# EAGLE design flight_computer (EAGLE 9.6.2)
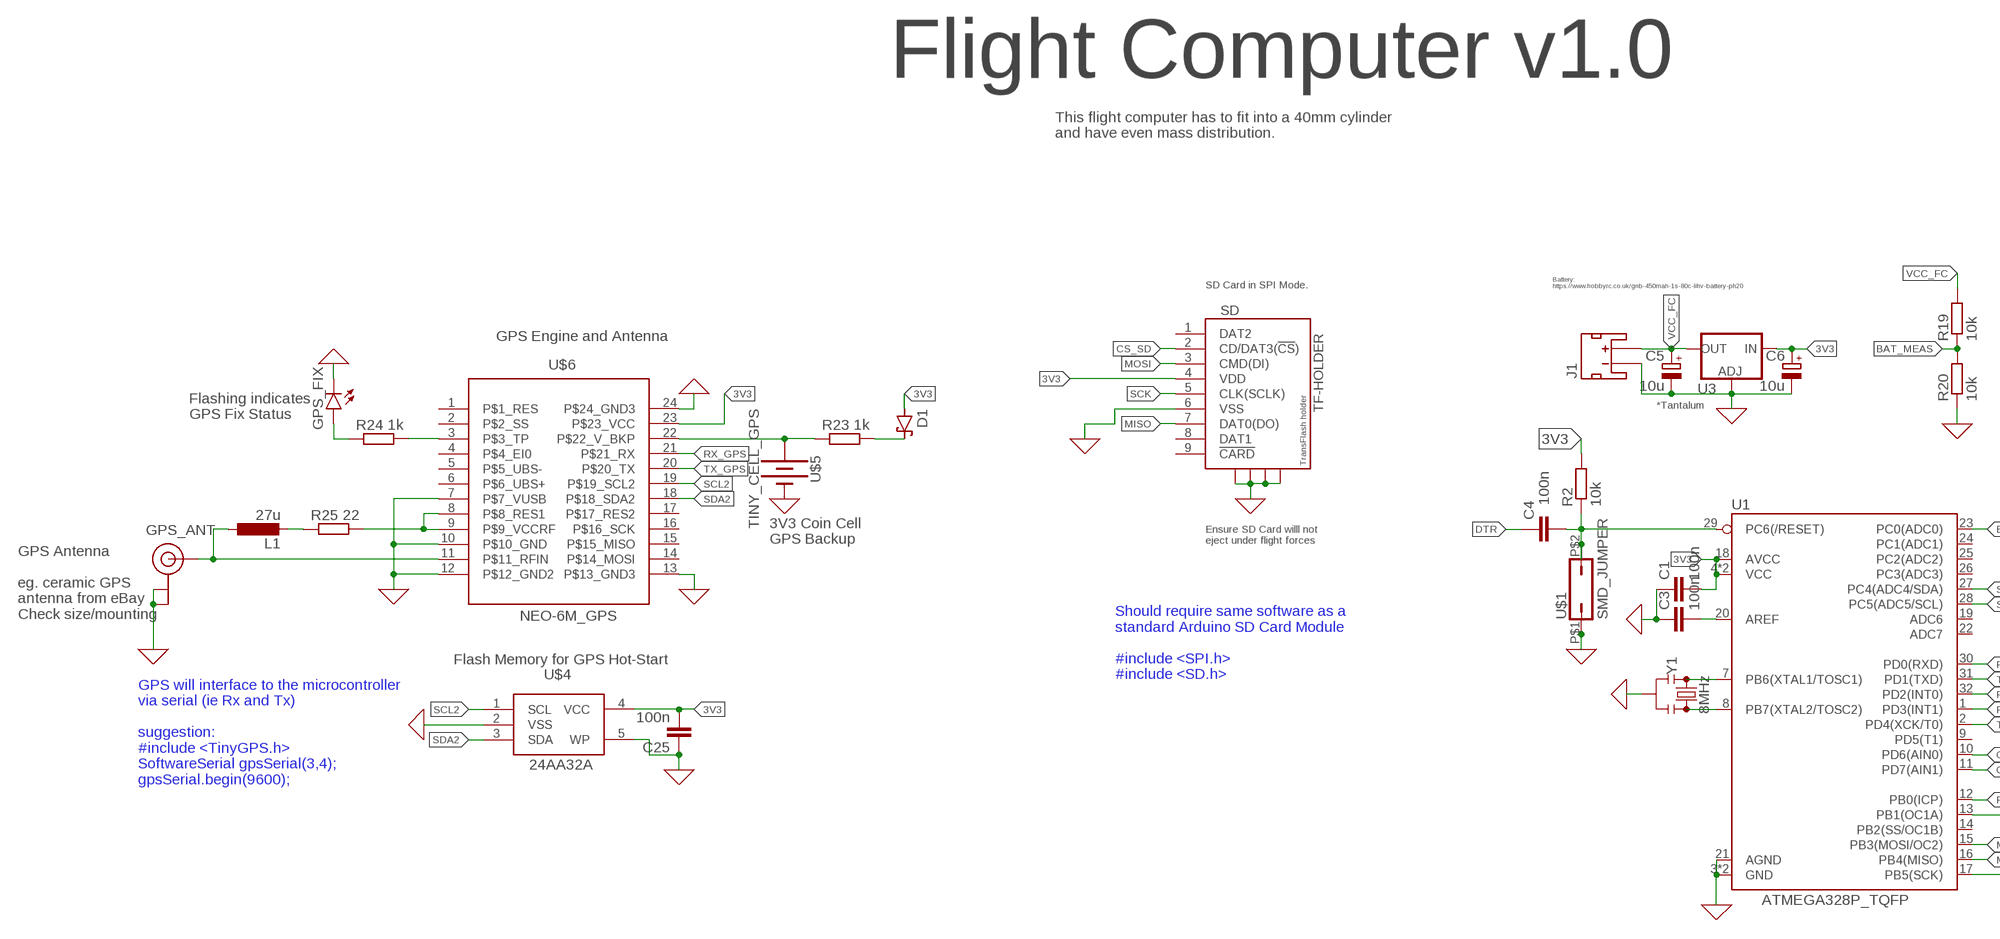
[diagram p0: schematic, sheet 1, part 1 of 2]
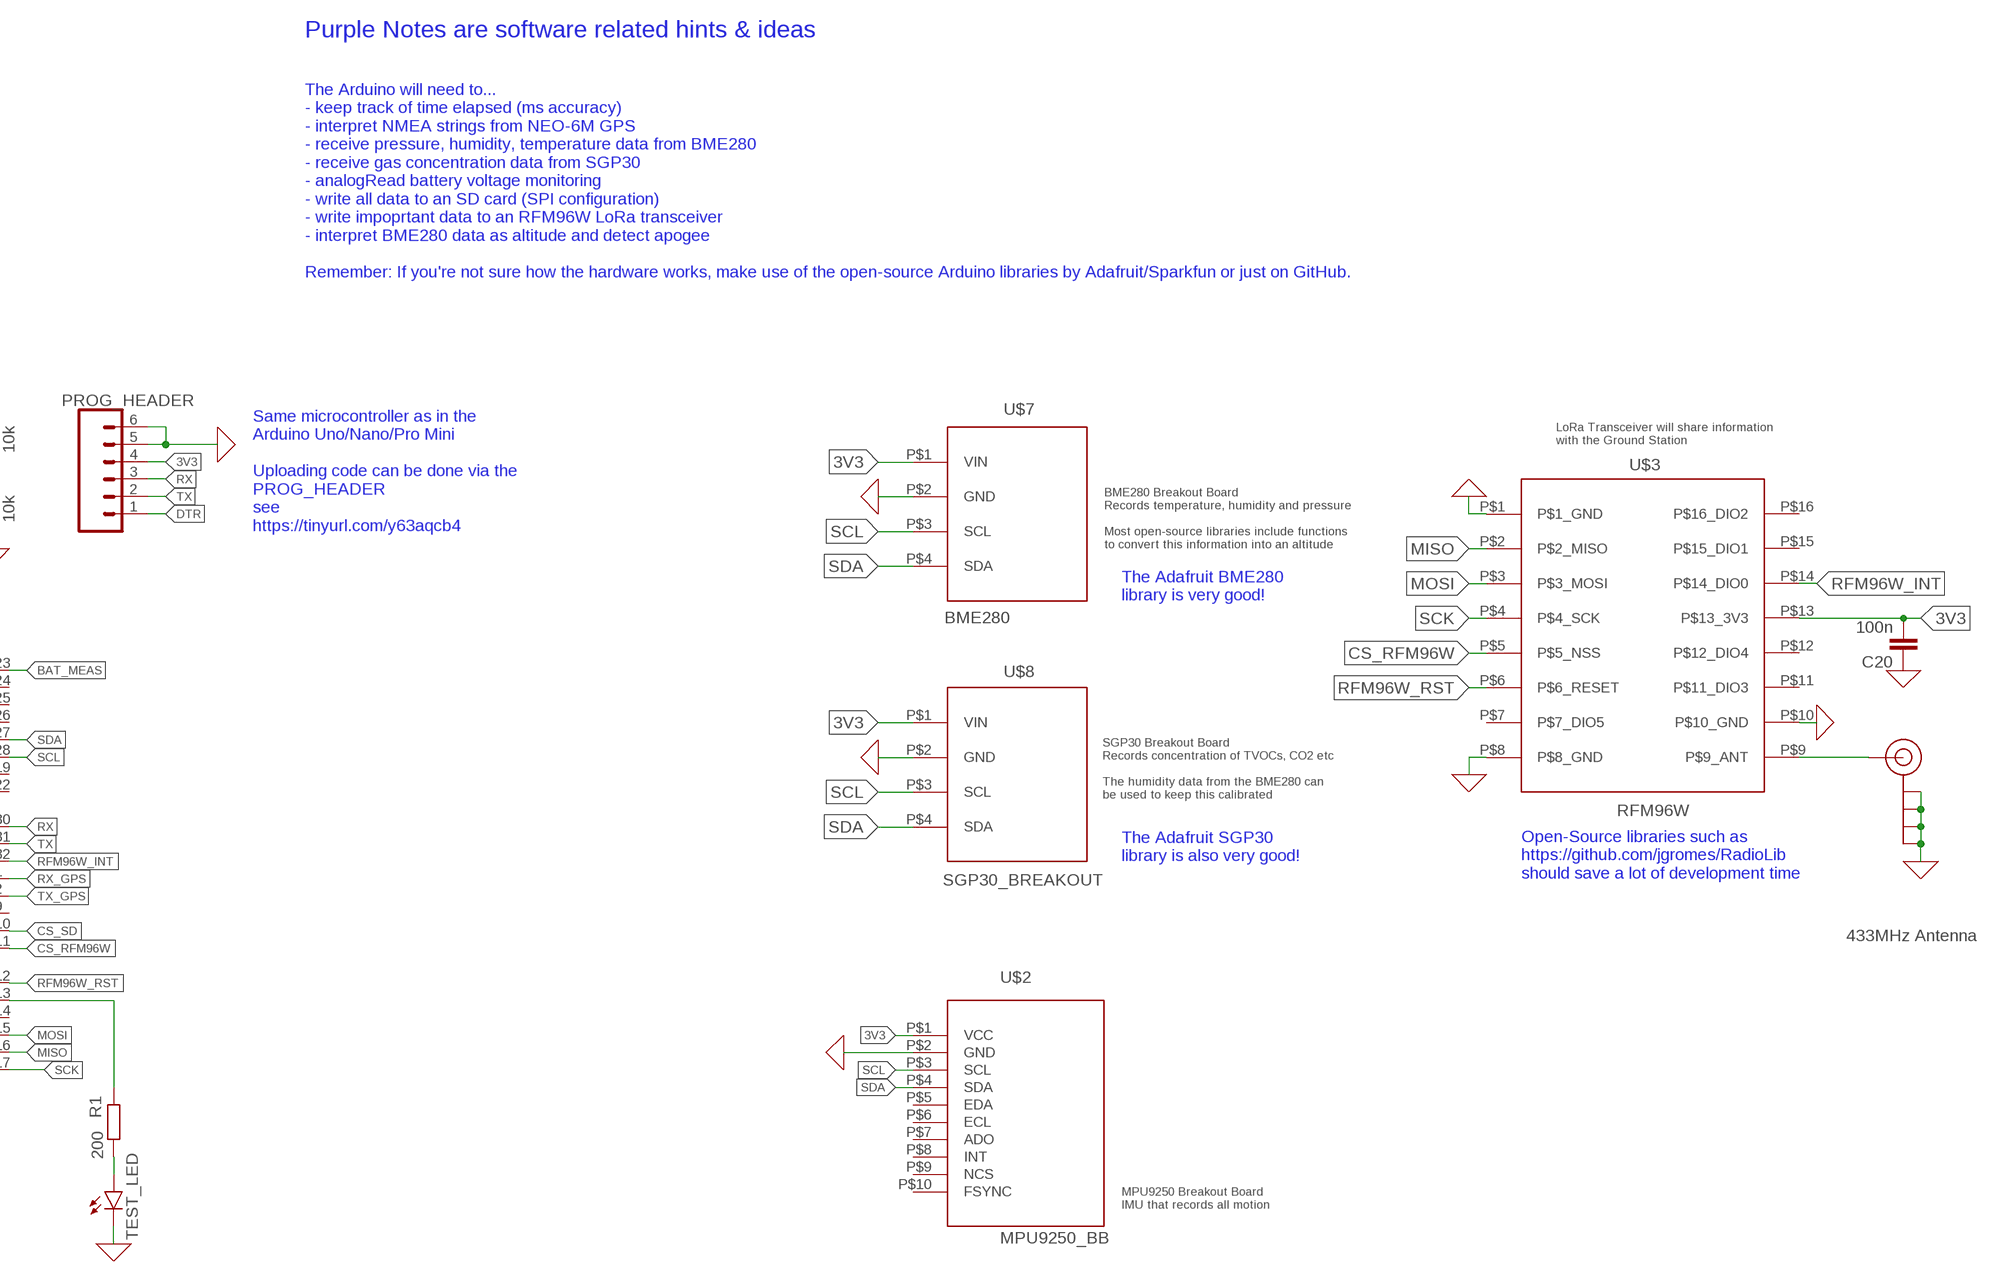
[diagram p1: schematic, sheet 1, part 2 of 2]

## Parts
C1  100n  C-EUC0603  [C0603]
C3  100n  C-EUC0603  [C0603]
C4  100n  C-EUC0603  [C0603]
C5  10u  CPOL-EUSMCA  [SMC_A]
C6  10u  CPOL-EUSMCA  [SMC_A]
C20  100n  C-EUC0603  [C0603]
C25  100n  C-EUC0603  [C0603]
D1  1A/40V/500mV  BAS40  [SOT23]
GPS_ANT  U.FL  [U.FL]
GPS_FIX  LEDCHIPLED_0603  [CHIPLED_0603]
J1  JST_2MM_MALE  [JST-2-SMD]
L1  27u  L-EUL1812  [L1812]
LORA_ANT  SMA_EDGE  [SMA-EDGE]
PROG_HEADER  CONN_06FEMALE_LOCK  [1X06_FEMALE_LOCK.010]
R1  200  R-EU_R0603  [R0603]
R2  10k  R-EU_R0603  [R0603]
R19  10k  R-EU_R0603  [R0603]
R20  10k  R-EU_R0603  [R0603]
R23  1k  R-EU_R0603  [R0603]
R24  1k  R-EU_R0603  [R0603]
R25  22  R-EU_R0603  [R0603]
SD  TF-HOLDER  [TF-PULL]
TEST_LED  LEDCHIPLED_0603  [CHIPLED_0603]
U1  ATMEGA328P_TQFP  [TQFP32-08]
U3  V_REG_LM1117SOT223  [SOT223]
U$1  SMD_JUMPER  [SMD_JUMPER]
U$2  MPU9250_BB  [MPU9250_BB]
U$3  RFM96W  [RFM96W]
U$4  24AA32A  [SOT23-5L]
U$5  TINY_CELL_GPS  [TINY_SMD_CELL]
U$6  NEO-6M_GPS  [NEO-M9N/M8T/M8U]
U$7  BME280  [BME280_BREAKOUT]
U$8  SGP30_BREAKOUT  [BME280_BREAKOUT]
Y1  8MHz  RESONATOR-8MHZSMD_3.2X1.3  [RESONATOR-SMD-3.2X1.3]

## Nets
0: C1.1 C3.1 C5.- C6.- C20.1 C25.1 GPS_ANT.1(GND) GPS_ANT.2(GND) GPS_FIX.C J1.1(-) LORA_ANT.GND@0(GND) LORA_ANT.GND@1(GND) LORA_ANT.GND@2(GND) LORA_ANT.GND@3(GND) PROG_HEADER.5 PROG_HEADER.6 R20.1 SD.6(VSS) SD.S1 SD.S2 SD.S3 SD.S4 TEST_LED.C U1.3(GND) U1.5(GND) U1.21(AGND) U3.1(ADJ) U$1.P$1 U$2.P$2(GND) U$3.P$1(P$1_GND) U$3.P$8(P$8_GND) U$3.P$10(P$10_GND) U$4.2(VSS) U$4.5(WP) U$5.P$1(-) U$6.7(P$7_VUSB) U$6.10(P$10_GND) U$6.12(P$12_GND2) U$6.13(P$13_GND3) U$6.24(P$24_GND3) U$7.P$2(GND) U$8.P$2(GND) Y1.2 ; supply symbol labelled GND
3V3: C1.2 C6.+ C20.2 C25.2 D1.1(A) PROG_HEADER.4 R2.2 SD.4(VDD) U1.4(VCC) U1.6(VCC) U1.18(AVCC) U3.3(IN) U$2.P$1(VCC) U$3.P$13(P$13_3V3) U$4.4(VCC) U$6.23(P$23_VCC) U$7.P$1(VIN) U$8.P$1(VIN)
BAT_MEAS: R19.1 R20.2 U1.23(PC0(ADC0))
CS_RFM96W: U1.11(PD7(AIN1)) U$3.P$5(P$5_NSS)
CS_SD: SD.2(CD/DAT3(!CS!)) U1.10(PD6(AIN0))
DTR: C4.1 PROG_HEADER.1
MISO: SD.7(DAT0(DO)) U1.16(PB4(MISO)) U$3.P$2(P$2_MISO)
MOSI: SD.3(CMD(DI)) U1.15(PB3(MOSI/OC2)) U$3.P$3(P$3_MOSI)
N$1: U1.7(PB6(XTAL1/TOSC1)) Y1.1
N$2: U1.8(PB7(XTAL2/TOSC2)) Y1.3
N$3: R1.1 U1.13(PB1(OC1A))
N$4: R1.2 TEST_LED.A
N$5: C4.2 R2.1 U1.29(PC6(/RESET)) U$1.P$2
N$10: C3.2 U1.20(AREF)
N$30: LORA_ANT.SIG(SIGNAL) U$3.P$9(P$9_ANT)
N$31: R23.1 U$5.P$2(+) U$6.22(P$22_V_BKP)
N$32: D1.3(C) R23.2
N$42: R24.2 U$6.3(P$3_TP)
N$43: GPS_FIX.A R24.1
N$46: R25.2 U$6.8(P$8_RES1) U$6.9(P$9_VCCRF)
N$47: GPS_ANT.FEED(SIGNAL) L1.1 U$6.11(P$11_RFIN)
N$48: L1.2 R25.1
RFM96W_INT: U1.32(PD2(INT0)) U$3.P$14(P$14_DIO0)
RFM96W_RST: U1.12(PB0(ICP)) U$3.P$6(P$6_RESET)
RX: PROG_HEADER.3 U1.30(PD0(RXD))
RX_GPS: U1.1(PD3(INT1)) U$6.21(P$21_RX)
SCK: SD.5(CLK(SCLK)) U1.17(PB5(SCK)) U$3.P$4(P$4_SCK)
SCL: U1.28(PC5(ADC5/SCL)) U$2.P$3(SCL) U$7.P$3(SCL) U$8.P$3(SCL)
SCL2: U$4.1(SCL) U$6.19(P$19_SCL2)
SDA: U1.27(PC4(ADC4/SDA)) U$2.P$4(SDA) U$7.P$4(SDA) U$8.P$4(SDA)
SDA2: U$4.3(SDA) U$6.18(P$18_SDA2)
TX: PROG_HEADER.2 U1.31(PD1(TXD))
TX_GPS: U1.2(PD4(XCK/T0)) U$6.20(P$20_TX)
VCC_FC: C5.+ J1.2(+) R19.2 U3.2(OUT) U3.4(OUT)
Unconnected: J1.NC1(PAD1) J1.NC2(PAD2) SD.1(DAT2) SD.8(DAT1) SD.9(!CARD) U1.9(PD5(T1)) U1.14(PB2(SS/OC1B)) U1.19(ADC6) U1.22(ADC7) U1.24(PC1(ADC1)) U1.25(PC2(ADC2)) U1.26(PC3(ADC3)) U$2.P$5(EDA) U$2.P$6(ECL) U$2.P$7(ADO) U$2.P$8(INT) U$2.P$9(NCS) U$2.P$10(FSYNC) U$3.P$7(P$7_DIO5) U$3.P$11(P$11_DIO3) U$3.P$12(P$12_DIO4) U$3.P$15(P$15_DIO1) U$3.P$16(P$16_DIO2) U$6.1(P$1_RES) U$6.2(P$2_SS) U$6.4(P$4_EI0) U$6.5(P$5_UBS-) U$6.6(P$6_UBS+) U$6.14(P$14_MOSI) U$6.15(P$15_MISO) U$6.16(P$16_SCK) U$6.17(P$17_RES2)

## Notes on the sheet
- Purple Notes are software related hints & ideas
- Flight Computer v1.0
- This flight computer has to fit into a 40mm cylinder
  and have even mass distribution.
- The Arduino will need to...
  - keep track of time elapsed (ms accuracy)
  - interpret NMEA strings from NEO-6M GPS
  - receive pressure, humidity, temperature data from BME280
  - receive gas concentration data from SGP30
  - analogRead battery voltage monitoring
  - write all data to an SD card (SPI configuration)
  - write impoprtant data to an RFM96W LoRa transceiver
  - interpret BME280 data as altitude and detect apogee
  
  Remember: If you're not sure how the hardware works, make use of the open-source Arduino libraries by Adafruit/Sparkfun or just on GitHub.
- SD Card in SPI Mode.
- Battery:
  https://www.hobbyrc.co.uk/gnb-450mah-1s-80c-lihv-battery-ph20
- LoRa Transceiver will share information
  with the Ground Station
- GPS Engine and Antenna
- *Tantalum
- Same microcontroller as in the 
  Arduino Uno/Nano/Pro Mini
  
  Uploading code can be done via the 
  PROG_HEADER
  see 
  https://tinyurl.com/y63aqcb4
- Flashing indicates 
  GPS Fix Status
- BME280 Breakout Board
  Records temperature, humidity and pressure
  
  Most open-source libraries include functions
  to convert this information into an altitude
- The Adafruit BME280
  library is very good!
- 3V3 Coin Cell 
  GPS Backup
- Ensure SD Card willl not
  eject under flight forces
- GPS Antenna
  
  eg. ceramic GPS
  antenna from eBay
  Check size/mounting
- SGP30 Breakout Board
  Records concentration of TVOCs, CO2 etc
  
  The humidity data from the BME280 can
  be used to keep this calibrated
- Flash Memory for GPS Hot-Start
- Should require same software as a 
  standard Arduino SD Card Module
  
  #include <SPI.h>
  #include <SD.h>
- The Adafruit SGP30
  library is also very good!
- Open-Source libraries such as
  https://github.com/jgromes/RadioLib
  should save a lot of development time
- 433MHz Antenna
- GPS will interface to the microcontroller
  via serial (ie Rx and Tx)
  
  suggestion:
  #include <TinyGPS.h>
  SoftwareSerial gpsSerial(3,4);
  gpsSerial.begin(9600);
- MPU9250 Breakout Board
  IMU that records all motion

## Library data of the parts
C1 C3 C4 C20 C25 = rcl:C-EU: CAPACITOR, European symbol; SPICEPREFIX: C
C5 C6 = rcl:CPOL-EU: POLARIZED CAPACITOR, European symbol; SPICEPREFIX: C
D1 = diode:BAS40: Silicon Schottky Diodes General-purpose diode for high-speed switching
GPS_ANT = SparkFun-Connectors:U.FL: SMD Antenna Connector - U.FL 2mm height, 3.0mm x 3.0mm receptacle size. SparkFun Products: SparkFun WiFi Shield - ESP8266 <https://www.sparkfun.com/products/13287> SparkFun ESP8266 Thing <https://www.sparkfun.com/products/13231> SparkFun MiniGen - Pro Mini Signal Generator Shield <https://www.sparkfun.com/products/11420>; PROD_ID: CONN-09193; SF_ID: WRL-09144
GPS_FIX TEST_LED = led:LED: LED OSRAM: - CHIPLED LG R971, LG N971, LY N971, LG Q971, LY Q971, LO R971, LY R971 LH N974, LH R974 LS Q976, LO Q976, LY Q976 LO Q996 - Hyper CHIPLED LW Q18S LB Q993, LB Q99A, LB R99A - SideLED LS A670, LO A670, LY A670, LG A670, LP A670 LB A673, LV A673, LT A673, LW A673 LH A674 LY A675 LS A676, LA A676, LO A676, LY A676, LW A676 LS A679, LY A679, LG A679 - Hyper Micro SIDELED® LS Y876, LA Y876, LO Y876, LY Y876 LT Y87S - SmartLED LW L88C, LW L88S LB L89C, LB L89S, LG L890 LS L89K, LO L89K, LY L89K LS L896, LA L896, LO L896, LY L896 - TOPLED LS T670, LO T670, LY T670, LG T670, LP T670 LSG T670, LSP T670, LSY T670, LOP T670, LYG T670 LG T671, LOG T671, LSG T671 LB T673, LV T673, LT T673, LW T673 LH T674 LS T676, LA T676, LO T676, LY T676, LB T676, LH T676, LSB T676, LW T676 LB T67C, LV T67C, LT T67C, LS T67K, LO T67K, LY T67K, LW E67C LS E67B, LA E67B, LO E67B, LY E67B, LB E67C, LV E67C, LT E67C LW T67C LS T679, LY T679, LG T679 LS T770, LO T770, LY T770, LG T770, LP T770 LB T773, LV T773, LT T773, LW T773 LH T774 LS E675, LA E675, LY E675, LS T675 LS T776, LA T776, LO T776, LY T776, LB T776 LHGB T686 LT T68C, LB T68C - Hyper Mini TOPLED® LB M676 - Mini TOPLED Santana® LG M470 LS M47K, LO M47K, LY M47K Source: http://www.osram.convergy.de LUXEON: - LUMILED® LXK2-PW12-R00, LXK2-PW12-S00, LXK2-PW14-U00, LXK2-PW14-V00 LXK2-PM12-R00, LXK2-PM12-S00, LXK2-PM14-U00 LXK2-PE12-Q00, LXK2-PE12-R00, LXK2-PE12-S00, LXK2-PE14-T00, LXK2-PE14-U00 LXK2-PB12-K00, LXK2-PB12-L00, LXK2-PB12-M00, LXK2-PB14-N00, LXK2-PB14-P00, LXK2-PB14-Q00 LXK2-PR12-L00, LXK2-PR12-M00, LXK2-PR14-Q00, LXK2-PR14-R00 LXK2-PD12-Q00, LXK2-PD12-R00, LXK2-PD12-S00 LXK2-PH12-R00, LXK2-PH12-S00 LXK2-PL12-P00, LXK2-PL12-Q00, LXK2-PL12-R00 Source: www.luxeon.com KINGBRIGHT: KA-3528ASYC Source: www.kingbright.com
J1 = SparkFun-Connectors:JST_2MM_MALE: Mates to single-cell LiPo batteries. CONN-08352; PROD_ID: CONN-08352
L1 = rcl:L-EU: INDUCTOR, European symbol; SPICEPREFIX: L
LORA_ANT = SparkFun-Retired:SMA_EDGE: SMA Antenna Connector End launch SMA connector. The paste layer has been removed so that the connector can be hand soldered onto the board after reflow.
PROG_HEADER = SparkFun-Connectors:CONN_06: Multi connection point. Often used as Generic Header-pin footprint for 0.1 inch spaced/style header connections On any of the 0.1 inch spaced packages, you can populate with these: Break Away Headers - Straight <https://www.sparkfun.com/products/116> (PRT-00116) Break Away Male Headers - Right Angle <https://www.sparkfun.com/products/553> (PRT-00553) Female Headers <https://www.sparkfun.com/products/115> (PRT-00115) Break Away Headers - Machine Pin <https://www.sparkfun.com/products/117> (PRT-00117) Break Away Female Headers - Swiss Machine Pin <https://www.sparkfun.com/products/743> (PRT-00743) Arduino Stackable Header - 6 Pin <https://www.sparkfun.com/products/9280> (PRT-09280) For SCREWTERMINALS and SPRING TERMINALS visit here: Screw Terimnals on SparkFun.com <https://www.sparkfun.com/search/results?term=Screw+Terminals> (5mm/3.5mm/2.54mm spacing) This device is also useful as a general connection point to wire up your design to another part of your project. Our various solder wires solder well into these plated through hole pads. Hook-Up Wire - Assortment (Stranded, 22 AWG) <https://www.sparkfun.com/products/11375> (PRT-11375) Hook-Up Wire - Assortment (Solid Core, 22 AWG) <https://www.sparkfun.com/products/11367> (PRT-11367) View the entire wire category on our website here <https://www.sparkfun.com/categories/141>
R1 R2 R19 R20 R23-R25 = rcl:R-EU_: RESISTOR, European symbol; SPICEPREFIX: R
SD = sd-mmc:TF-HOLDER: TF / Micro SD socket is PUSH-PUSH type, the card can be pushed into and auto locked and pushed out by simply press the card. Surface Mounting type.
U1 = SparkFun-IC-Microcontroller:ATMEGA328P_TQFP: Popular 328P in QFP Storefront component: ATmega328 - TQFP <https://www.sparkfun.com/products/13448> (COM-13448) Datasheet <http://www.sparkfun.com/datasheets/Components/SMD/ATMega328.pdf> SparkFun Products SparkFun RedBoard - Programmed with Arduino <https://www.sparkfun.com/products/12757> (DEV-12757) Arduino Pro Mini 328 - 5V/16MHz <https://www.sparkfun.com/products/11113> (DEV-11113) Arduino Pro Mini 328 - 3.3V/8MHz <https://www.sparkfun.com/products/11114> (DEV-11114) SparkFun OpenLog <https://www.sparkfun.com/products/13712> (DEV-13712) SparkFun MicroView - OLED Arduino Module <https://www.sparkfun.com/products/12923> (DEV-12923) SparkFun Digital Sandbox <https://www.sparkfun.com/products/12651> (DEV-12651) SparkFun PicoBoard <https://www.sparkfun.com/products/11888> (WIG-11888) Arduino Fio <https://www.sparkfun.com/products/10116> (DEV-10116) LilyPad Arduino 328 Main Board <https://www.sparkfun.com/products/13342> (DEV-13342) SparkFun RedStick <https://www.sparkfun.com/products/13741> (DEV-13741) LilyPad MP3 <https://www.sparkfun.com/products/11013> (DEV-11013) LilyPad Arduino SimpleSnap <https://www.sparkfun.com/products/10941> (DEV-10941) SparkFun Stepoko <https://www.sparkfun.com/products/13899> (ROB-13899) SparkFun Geiger Counter <https://www.sparkfun.com/products/11345> (SEN-11345) SparkFun EL Sequencer <https://www.sparkfun.com/products/12781> (COM-12781) Arduino Pro 328 - 5V/16MHz <https://www.sparkfun.com/products/10915> (DEV-10915) CryptoCape <https://www.sparkfun.com/products/12773> (DEV-12773) SparkFun IR Thermometer Evaluation Board - MLX90614 <https://www.sparkfun.com/products/10740> (SEN-10740) SparkFun RedBot Mainboard <https://www.sparkfun.com/products/12097> (ROB-12097) Arduino Pro 328 - 3.3V/8MHz <https://www.sparkfun.com/products/10914> (DEV-10914) SparkFun Block for Intel® Edison - Arduino <https://www.sparkfun.com/products/13036> (DEV-13036) SparkFun Simon Says - Surface Mount Soldering Kit <https://www.sparkfun.com/products/10935> (KIT-10935) SparkFun 7-Segment Serial Display - Red <https://www.sparkfun.com/products/11441> (COM-11441) SparkFun 7-Segment Serial Display - White <https://www.sparkfun.com/products/11629> (COM-11629) SparkFun 7-Segment Serial Display - Yellow <https://www.sparkfun.com/products/11443> (COM-11443) SparkFun 7-Segment Serial Display - Kelly Green <https://www.sparkfun.com/products/11440> (COM-11440) SparkFun 7-Segment Serial Display - Blue <https://www.sparkfun.com/products/11442> (COM-11442) SparkFun OpenSegment Serial Display - 20mm (Blue) <https://www.sparkfun.com/products/11647> (COM-11647) SparkFun OpenSegment Serial Display - 20mm (Green) <https://www.sparkfun.com/products/11646> (COM-11646) SparkFun OpenSegment Serial Display - 20mm (White) <https://www.sparkfun.com/products/11648> (COM-11648) SparkFun OpenSegment Serial Display - 20mm (Red) <https://www.sparkfun.com/products/11644> (COM-11644) SparkFun OpenSegment Serial Display - 20mm (Yellow) <https://www.sparkfun.com/products/11645> (COM-11645) SparkFun OpenSegment Shield <https://www.sparkfun.com/products/13190> (DEV-13190); PROD_ID: IC-09069
U3 = SparkFun-IC-Power:V_REG_LM1117: Voltage Regulator LM1117 Standard adjustable voltage regulator but in SMD form. Spark Fun Electronics SKU : COM-00595; PROD_ID: VREG-08170
U$1 = Josh's_Lib:SMD_JUMPER: SMD Jumper for reset, just short the pads
U$2 = Josh's_Lib:MPU9250_BB: MPU9250 Breakout Board
U$3 = Josh's_Lib:RFM96W: RFM96W LoRa Transciever https://cdn.sparkfun.com/assets/learn_tutorials/8/0/4/RFM95_96_97_98W.pdf
U$4 = Josh's_Lib:24AA32A: 24AA32A http://ww1.microchip.com/downloads/en/DeviceDoc/21713M.pdf https://uk.rs-online.com/web/p/eeprom/8230701/
U$5 = Josh's_Lib:TINY_CELL_GPS: a tiny cell copied form the neo-6m GPS breakout board
U$6 = Josh's_Lib:NEO-6M_GPS: NEO-6M GPS https://www.u-blox.com/sites/default/files/products/documents/NEO-6_DataSheet_%28GPS.G6-HW-09005%29.pdf
U$7 = Josh's_Lib:BME280
U$8 = Josh's_Lib:SGP30_BREAKOUT: SGP30 Breakout Board
Y1 = SparkFun-Clocks:RESONATOR-8MHZ: 8MHz Resonator Digikey Example <http://www.digikey.com/product-detail/en/murata-electronics-north-america/CSTCE10M0G55-R0/490-1196-1-ND/584633> Frequency: 8MHz Frequency Stability: ±0.2% Frequency Tolerance: ±0.5% Capacitance: 33pF SparkFun Products Arduino Pro Mini 328- 3.3V/8MHz <https://www.sparkfun.com/products/11114> SparkFun Digital Sandbox <https://www.sparkfun.com/products/12651>; PROD_ID: XTAL-08895

## Module VE
Ports: 

### Library data of the parts

## Net classes
1 vcc: width 0.203 mm

## Board
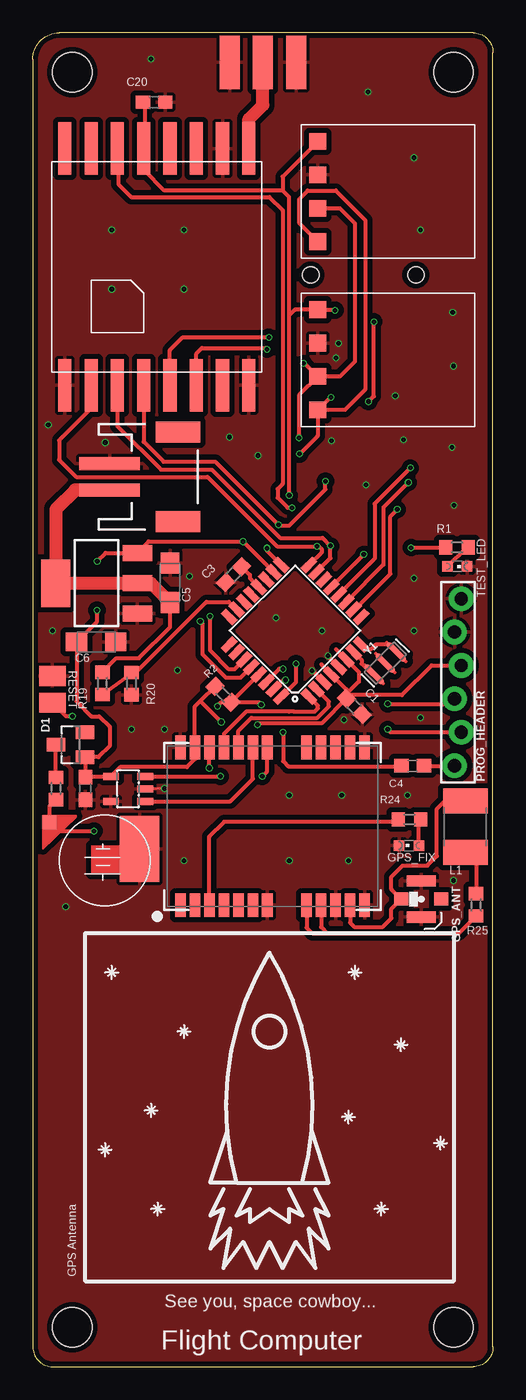
[diagram p2: board, top side]
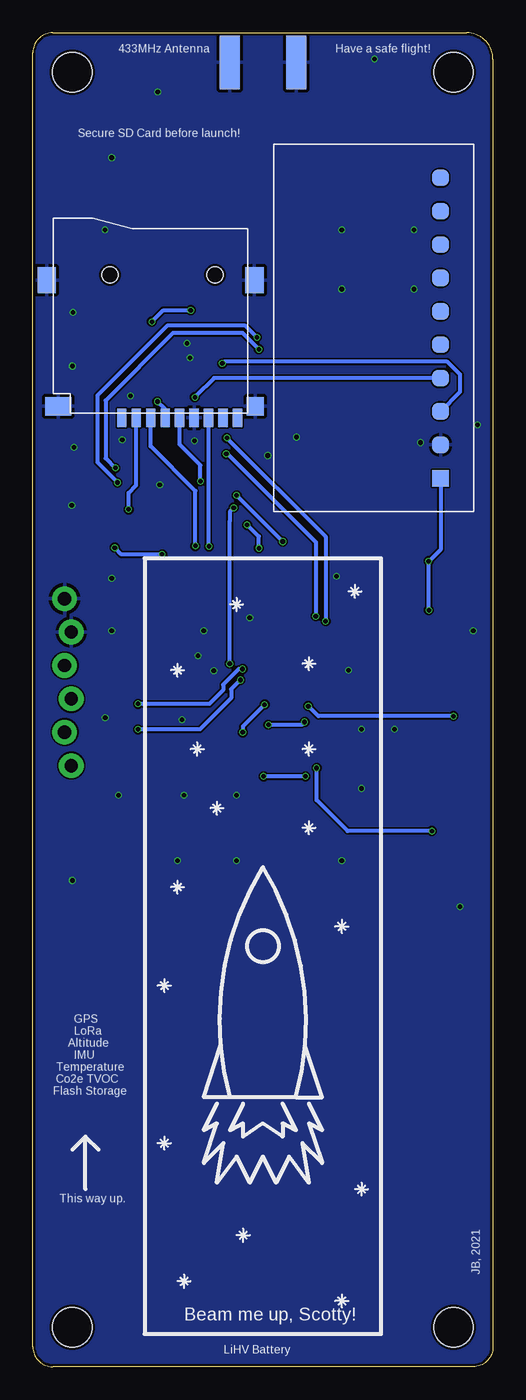
[diagram p3: board, bottom side, seen from below]

Size 35 x 101.5 mm. Coordinates in mm from the lower left corner, seen from the top.
Outline: 1.5,0 33.5,0 arc90 35,1.5 35,100 arc90 33.5,101.5 2,101.5 arc90 0,99.5 0,1.5 arc90 1.5,0
Copper layers (1*16): Top 0.035mm / dielectric 1.6mm / Bottom 0.035mm
Design rules "jlcpcb-2layers": minimum track width 5mil, minimum drill 0.3mm, track to track 5mil, track to pad 5mil, pad to pad 5mil, via to via 5mil, smd to smd 5mil, copper to edge 0.2mm, drill to drill 6mil, minimum pad ring 10mil, minimum via ring 3mil, stop-mask expansion 4mil, vias tented up to drill 0mil, thermal gap 10mil
Holes 3 mm at 3,3 32,3 3,98.5 32,98.5

### Footprints (pad centres in the part's own frame; a part is rotated, then mirrored left to right if it is on the bottom)
C0603 = smd 1.1 x 1: 1 -0.85,0; 2 0.85,0
SMC_A = smd 1.6 x 1.4: + -1.5,0; - 1.5,0
SOT23 = smd 1 x 1.4: 1 -0.95,-1.1; 2 0.95,-1.1; 3 0,1.1
U.FL = smd 2.2 x 0.85: 1 0,1.375; 2 0,-1.375 | smd 1.05 x 1: FEED 1.525,0; NC -1.525,0
CHIPLED_0603 = smd 0.8 x 0.8: A 0,-0.75; C 0,0.75
JST-2-SMD = smd 1 x 4.6: 1 -1,-3.7; 2 1,-3.7 | smd 1.6 x 3.4: NC1 -3.4,1.5; NC2 3.4,1.5
L1812 = smd 1.9 x 3.4: 1 -1.95,0; 2 1.95,0
SMA-EDGE = smd 1.524 x 4.064: GND@0 0,0; GND@1 5.08,0; SIG 2.54,0 | smd 1.524 x 4.064 bottom: GND@2 0,0; GND@3 5.08,0
1X06_FEMALE_LOCK.010 = drill 1.016 pad 1.88: 1 0,0.254; 2 2.54,-0.254; 3 5.08,0.254; 4 7.62,-0.254; 5 10.16,0.254; 6 12.7,-0.254
R0603 = smd 1 x 1.1: 1 -0.85,0; 2 0.85,0
TF-PULL = smd 0.7 x 1.4: 1 -2.2,-7.62; 2 -1.1,-7.62; 3 0,-7.62; 4 1.1,-7.62; 5 2.2,-7.62; 6 3.3,-7.62; 7 4.4,-7.62; 8 5.5,-7.62; 9 6.6,-7.62 | smd 1.4 x 2: S1 -7.9,2.85; S2 7.9,2.85 | smd 1.28 x 1.4: S3 7.96,-6.75 | smd 1.95 x 1.4: S4 -7.025,-6.75 | hole 1.25: -3.1,3.25; 4.9,3.25
TQFP32-08 = smd 1.27 x 0.559: 1 -4.293,2.8; 2 -4.293,2; 3 -4.293,1.2; 4 -4.293,0.4; 5 -4.293,-0.4; 6 -4.293,-1.2; 7 -4.293,-2; 8 -4.293,-2.8; 17 4.293,-2.8; 18 4.293,-2; 19 4.293,-1.2; 20 4.293,-0.4; 21 4.293,0.4; 22 4.293,1.2; 23 4.293,2; 24 4.293,2.8 | smd 0.559 x 1.27: 9 -2.8,-4.293; 10 -2,-4.293; 11 -1.2,-4.293; 12 -0.4,-4.293; 13 0.4,-4.293; 14 1.2,-4.293; 15 2,-4.293; 16 2.8,-4.293; 25 2.8,4.293; 26 2,4.293; 27 1.2,4.293; 28 0.4,4.293; 29 -0.4,4.293; 30 -1.2,4.293; 31 -2,4.293; 32 -2.8,4.293
SOT223 = smd 1.219 x 2.235: 1 -2.311,-3.099; 2 0,-3.099; 3 2.311,-3.099 | smd 3.6 x 2.2: 4 0,3.099
SMD_JUMPER = smd 1.5 x 2: P$1 0,0; P$2 2.032,0
MPU9250_BB = smd 1.27 x 1.27: P$1 0,0; P$2 0,-2.54; P$3 0,-5.08; P$4 0,-7.62; P$5 0,-10.16; P$6 0,-12.7; P$7 0,-15.24; P$8 0,-17.78; P$9 0,-20.32; P$10 0,-22.86
RFM96W = smd 4 x 1: P$1 -1,15; P$2 -1,13; P$3 -1,11; P$4 -1,9; P$5 -1,7; P$6 -1,5; P$7 -1,3; P$8 -1,1; P$9 17,1; P$10 17,3; P$11 17,5; P$12 17,7; P$13 17,9; P$14 17,11; P$15 17,13; P$16 17,15
SOT23-5L = smd 0.55 x 1.2: 1 -0.95,-1.3; 2 0,-1.3; 3 0.95,-1.3; 4 0.95,1.3; 5 -0.95,1.3
TINY_SMD_CELL = smd 3 x 5: P$1 1.524,2.54 | smd 1 x 1: P$2 8.382,0.508
NEO-M9N/M8T/M8U = smd 1.8 x 0.8: 1 6,-7; 2 6,-5.9; 3 6,-4.8; 4 6,-3.7; 5 6,-2.6; 6 6,-1.5; 7 6,-0.4; 8 6,2.6; 9 6,3.7; 10 6,4.8; 11 6,5.9; 12 6,7; 13 -6,7; 14 -6,5.9; 15 -6,4.8; 16 -6,3.7; 17 -6,2.6; 18 -6,-0.4; 19 -6,-1.5; 20 -6,-2.6; 21 -6,-3.7; 22 -6,-4.8; 23 -6,-5.9; 24 -6,-7
BME280_BREAKOUT = smd 1.27 x 1.27: P$1 0,3.81; P$2 0,1.27; P$3 0,-1.27; P$4 0,-3.81
RESONATOR-SMD-3.2X1.3 = smd 0.45 x 1.905: 1 -1.2,0; 2 0,0; 3 1.2,0

### Placement (x,y rotation side)
C1  24.45,50.23 135 top
C3  15.27,60.28 45 top
C4  28.89,45.73 180 top
C5  10.44,59.66 90 top
C6  4.82,55.15 0 top
C20  9.22,96.23 180 top
C25  4,43.99 90 top
D1  2.86,47.33 90 top
GPS_ANT  29.54,35.58 180 top
GPS_FIX  28.62,39.66 90 top
J1  9.53,67.71 270 top
L1  32.9,41.09 270 top
LORA_ANT  14.96,99.26 0 top
PROG_HEADER  32.33,45.74 90 top
R1  32.27,62.34 0 top
R2  14.47,51.16 135 top
R19  5.28,51.99 90 top
R20  7.5,51.98 90 top
R23  1.76,43.99 90 top
R24  28.65,41.64 180 top
R25  33.72,35.14 270 top
SD  26.04,79.83 0 bottom
TEST_LED  32.29,60.89 270 top
U1  19.95,56 135 top
U3  4.85,59.62 90 top
U$1  1.49,52.56 270 top
U$2  3.99,67.61 180 bottom
U$3  17.43,75.69 90 top
U$4  7.24,43.97 90 top
U$5  9.65,41.94 180 top
U$6  18.23,41.12 270 top
U$7  21.67,89.42 0 top
U$8  21.67,76.62 0 top
Y1  26.8,53.54 45 top

### Tracks (layer width: path | path; a pad name or v marks a point on that pad's centre or on a via)
0  (via drill 0.35)
  Top 0.2: U$4.2 8.54,44 v10,44
  Top 0.3: U1.5 22.45,54.07 v22.45,54.09 | U1.3 22.09,52.12 v21.24,52.97
  other vias: 10,48.5 7.5,48.5 19.5,43.5 23.5,43.5 28.5,43.5 24,38.5 19.5,38.5 11.5,38.5 2.5,35 32,37 18.5,57 22,56 29,56 29,60 11.91,60.13 1.17,71.68 5.51,70.32 14.95,70.74 17.13,69.33 22.71,70.44 25.35,67.12 28.2,70.53 32.04,65.55 31.88,69.96 32,76.14 31.94,80.23 6,86.5 6,82 11.5,86.5 11.5,82 29.5,86.5 29,92 25.5,97 9,99.5 11,53 1.5,56 29.49,49.39 23.66,49.24 23.26,77.87 23.06,76.77 27.57,73.88
  pour Top (isolate 0.4): -0.5,-0.5 -0.5,102 14,102 35.5,102 35.5,97.5 35.5,-0.5 1.5,-0.5
  pour Bottom: -0.5,-1 36,-1 36,0 36,102.5 24,102.5 -1,102.5 -1,99.5 -1,-1
3V3  (via drill 0.35)
  Top 0.3: 23.85,51.17 23.85,51.54 U1.4 21.95,53.43 | 23.85,51.17 C1.2 | U1.18 v15.99,62.79 8.81,62.79 U3.3 5.53,61.93 v4.9,61.3 | v4.88,57.57 4.88,56.71 C6.+ 3.32,50.63 4.46,49.49 5.05,49.49 5.83,48.71 5.83,47.22 4.99,46.38 D1.1 4,46.34 C25.2 4.08,44.92 U$4.4 6.65,45.63 11.72,45.63 12.33,46.24 U$6.23 12.33,50.22 12.75,50.64 | R2.2 12.75,50.64 | 23.07,54.58 U1.6 24.8,52.85 24.8,52.12 23.85,51.17 | C1.2 24.12,51.1 28.07,51.1 30.33,53.36 PROG_HEADER.4 | C1.2 21.97,48.95 17.18,48.95 v17.08,48.85 | v14.33,49.06 12.75,50.64 | C20.2 8.5,96.1 8.5,92.76 | 8.5,92.76 U$3.P$13 | 19,89.5 19.5,89 19.5,80 | 8.5,92.76 8.5,91 10,89.5 19,89.5 | v19.5,66.3 19.5,80 | U$7.P$1 19,90.56 19,89.5 | 19.5,80 19.93,80.43 U$8.P$1 21.71,80.39 v22.99,80.39 | v25.53,73.44 25.94,73.85 v25.94,79.52
  Bottom 0.3: v4.88,57.57 4.88,61.28 | 4.88,61.28 v4.9,61.3 | v17.08,48.85 14.54,48.85 v14.33,49.06 | U$2.P$1 3.99,62.17 4.88,61.28 | v15.99,62.79 v19.5,66.3 | SD.4 24.94,72.85 v25.53,73.44 | v25.94,79.52 25.07,80.39 v22.99,80.39
BAT_MEAS
  Top 0.3: R19.1 7.24,52.56 R20.2 7.83,52.83 13.2,58.2 14.91,58.2 U1.23
CS_RFM96W  (via drill 0.35)
  Top 0.3: U$3.P$5 10.43,77.35 11.41,78.33 v17.95,78.33 | v28.56,67.28 26.67,65.39 26.67,61.02 U1.11
  Bottom 0.3: v17.95,78.33 18.83,79.21 24.79,79.21 30.1,73.9 30.1,68.82 v28.56,67.28
CS_SD  (via drill 0.35)
  Top 0.3: U1.10 24.48,57.62 27.19,60.33 27.19,64.7 v27.72,65.23
  Bottom 0.3: v27.72,65.23 27.72,66.49 27.14,67.07 SD.2
DTR
  Top 0.3: C4.1 32.06,45.72 PROG_HEADER.1
MISO  (via drill 0.35)
  Top 0.3: U$3.P$2 4.43,72.93 2,70.5 2,69 3.3,67.7 13.3,67.7 18.58,62.42 v21.6,62.42 21.75,62.42 21.96,62.21 21.96,61.97 U1.16
  Bottom 0.3: SD.7 21.64,62.46 v21.6,62.42
MOSI  (via drill 0.35)
  Top 0.3: U$3.P$3 6.43,71.57 9.75,68.25 13.61,68.25 18.8,63.06 22.04,63.06 v22.64,62.46 22.64,61.52 U1.15
  Bottom 0.3: v22.64,62.46 22.64,66.64 26.04,70.04 SD.3
N$1
  Top 0.3: U1.7 25,53.78 25,53.5 25.81,52.69 Y1.1
N$2
  Top 0.3: U1.8 25.29,54.62 25.76,54.62 26.13,54.99 27.05,54.99 Y1.3
N$3  (via drill 0.35)
  Top 0.3: U1.13 25.17,61.79 v25.17,61.81 | v28.77,62.32 28.79,62.34 R1.1
  Bottom 0.3: v25.17,61.81 27.5,61.81 28.26,61.81 v28.77,62.32
N$4
  Top 0.3: TEST_LED.A 32.99,62.34 R1.2
N$5  (via drill 0.35)
  Top 0.3: R2.1 U1.29 | R2.1 17.19,50.56 v17.37,50.38 | v19.03,48.27 19.03,46.09 19.43,45.69 28,45.69 C4.2 | U$1.P$2 2.52,49.5 v3,49.5 | v14.05,50.27 14.34,50.56 R2.1
  Bottom 0.3: v17.37,50.38 19.03,48.72 v19.03,48.27 | v3,49.5 13.28,49.5 v14.05,50.27
N$10
  Top 0.3: C3.2 16.5,60.25 16.5,60 17.18,59.32 U1.20
N$30
  Top 1: U$3.P$9 16.43,94.93 17.5,96 LORA_ANT.SIG 17.5,100
N$31  (via drill 0.35)
  Top 0.3: R23.1 1.27,42.65 U$5.P$2 1.94,40.76 v4.65,40.76 | v13.42,45.56 U$6.22
  Bottom 0.3: v4.65,40.76 11.06,40.76 13.42,43.12 v13.42,45.56
N$32
  Top 0.3: R23.2 D1.3
N$42
  Top 0.3: U$6.3 13.43,40.34 14.54,41.45 27.61,41.45 R24.2
N$43
  Top 0.3: GPS_FIX.A 29.37,41.51 R24.1
N$46
  Top 0.3: U$6.9 21.93,33.45 22.4,32.98 | 22.4,32.98 23.08,32.98 32.41,32.98 R25.2 | U$6.8 20.83,33.4 21.25,32.98 22.4,32.98
N$47
  Top 0.3: 24.16,35.15 U$6.11 24.13,33.78 24.44,33.47 26.62,33.47 27.27,34.12 27.27,34.84 GPS_ANT.FEED 27.27,36.33 27.27,37.28 28.13,38.14 30.02,38.14 30.73,38.85 30.73,42.45 31.32,43.04 L1.1
N$48
  Top 0.3: L1.2 33.72,38.32 R25.1
RFM96W_INT  (via drill 0.35)
  Top 0.3: U1.32 20.02,52.11 v20.02,53.5 | U$3.P$14 6.5,92.62 6.5,90 7.5,89 18,89 19,88 19,67.17 18.62,66.79 18.62,66.12 19.38,65.36 v19.72,65.36
  Bottom 0.3: v20.02,53.5 20.02,64.37 20.02,64.52 20.02,65.06 v19.72,65.36
RFM96W_RST  (via drill 0.35)
  Top 0.3: U$3.P$6 12.43,77.1 12.85,77.52 17.71,77.52 v17.81,77.42 | v28.72,68.39 26,65.67 26,61.48 U1.12
  Bottom 0.3: v17.81,77.42 19.05,78.66 24.34,78.66 29.47,73.53 29.47,69.14 v28.72,68.39
RX  (via drill 0.35)
  Top 0.3: U1.30 18.74,53.09 v19.04,53.09 | v27,50.44 31.69,50.44 PROG_HEADER.3
  Bottom 0.3: v19.04,53.09 19.33,53.09 20.52,51.9 20.52,51.49 21.57,50.44 v27,50.44
RX_GPS
  Top 0.3: U$6.21 14.53,48.16 16.22,49.85 19.5,49.85 19.87,49.85 21.43,49.85 21.68,50.1 21.68,50.31 U1.1
SCK  (via drill 0.35)
  Top 0.3: U$3.P$4 8.43,70.39 9.95,68.87 13.89,68.87 v18.7,64.06 18.76,64 19.5,64 22.26,66.76 v22.26,67.38 | U1.17 17.81,62.1 v17.81,62.29
  Bottom 0.3: v22.26,67.38 22.26,68.59 23.84,70.17 SD.5 | v17.81,62.29 17.81,63.17 v18.7,64.06
SCL  (via drill 0.35)
  Top 0.3: U1.28 15.79,52.41 14.71,52.41 12.92,54.2 12.92,56.53 v12.73,56.72 | U$7.P$3 23.35,88.15 24.5,87 24.5,76.5 23.35,75.35 U$8.P$3 | U$8.P$3 20.24,73.92 v20.24,70.67 | v20.59,76.34 20.68,76.34 U$8.P$3
  Bottom 0.3: v12.73,56.72 12.73,63.16 v20.24,70.67 | U$2.P$3 2.5,74.18 2.5,75.5 3.47,76.47 20.46,76.47 v20.59,76.34
SCL2
  Top 0.3: U$4.1 15.02,43.02 16.73,44.73 U$6.19
SDA  (via drill 0.35)
  Top 0.3: U1.27 15.32,53.07 14.91,53.07 13.5,54.48 13.5,57.09 v13.48,57.11 | U$7.P$4 20.28,87 20.28,88.86 20.91,89.49 23.05,89.49 25.28,87.26 25.28,74.35 23.74,72.81 U$8.P$4 21.67,72.77 | 21.67,72.77 21.67,70.83 v20.29,69.45 | v22.67,73.77 21.67,72.77
  Bottom 0.3: v20.29,69.45 20.18,69.45 13.48,62.75 v13.48,57.11 | U$2.P$4 21.22,75.23 22.56,73.89 22.56,73.88 v22.67,73.77
SDA2  (via drill 0.35)
  Top 0.3: U$4.3 v14.26,44.92 | v17.45,44.92 17.83,45.3 U$6.18
  Bottom 0.3: v14.26,44.92 v17.45,44.92
TX  (via drill 0.35)
  Top 0.3: U1.31 19.03,52.25 v19.21,52.25 | v27,48.5 27.22,48.28 PROG_HEADER.2
  Bottom 0.3: v19.21,52.25 19.91,51.55 19.91,50.88 22.29,48.5 v27,48.5
TX_GPS
  Top 0.3: U$6.20 15.63,48.39 16.62,49.38 21.64,49.38 22.51,50.25 22.51,50.61 U1.2
VCC_FC
  Top 0.3: R19.2 6.36,53.92 8.07,53.92 10.44,56.29 C5.+
  Top 1: J1.2 3.21,66.71 1.75,65.25 U3.4 U3.2 8.98,59.62 C5.+

### Text on the board
tPlace: RESET | GPS Antenna | See you, space cowboy... | Flight Computer
bPlace: Have a safe flight! | 433MHz Antenna | Secure SD Card before launch! | GPS / LoRa / Altitude / IMU / Temperature / Co2e TVOC / Flash Storage | This way up. | JB, 2021 | Beam me up, Scotty! | LiHV Battery